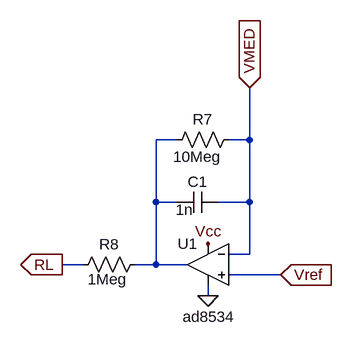
[diagram p0: schematic RLD.asc]
RLD.asc, the LTspice schematic file:
Version 4.1
SHEET 1 880 680
WIRE 240 192 208 192
WIRE 352 192 352 112
WIRE 352 192 320 192
WIRE 208 288 208 192
WIRE 240 288 208 288
WIRE 352 288 352 192
WIRE 352 288 304 288
WIRE 352 368 352 288
WIRE 352 368 320 368
WIRE 96 384 64 384
WIRE 208 384 208 288
WIRE 208 384 176 384
WIRE 256 384 208 384
WIRE 400 400 320 400
WIRE 288 432 288 416
FLAG 400 400 Vref
IOPIN 400 400 In
FLAG 64 384 RL
IOPIN 64 384 Out
FLAG 288 352 Vcc
FLAG 288 432 0
FLAG 352 112 VMED
IOPIN 352 112 In
SYMBOL OpAmps\\opamp2 288 320 M0
WINDOW 3 -42 144 Left 2
SYMATTR Value ad8534
SYMATTR InstName U1
SYMBOL cap 304 272 R90
WINDOW 0 0 32 VBottom 2
WINDOW 3 43 52 VBottom 2
SYMATTR InstName C1
SYMATTR Value 1n
SYMBOL res 192 368 R90
WINDOW 0 0 56 VBottom 2
WINDOW 3 54 59 VBottom 2
SYMATTR InstName R8
SYMATTR Value 1Meg
SYMBOL res 336 176 R90
WINDOW 0 0 56 VBottom 2
WINDOW 3 58 64 VBottom 2
SYMATTR InstName R7
SYMATTR Value 10Meg

The netlist it stands for:
* RLD.asc
X§U1 Vref VMED Vcc 0 N001 ad8534  ; pins In+ In- V+ V- OUT
C1 VMED N001 1n
R8 N001 RL 1Meg
R7 VMED N001 10Meg
.backanno
.end